# EAGLE design VGA_sound (EAGLE 7.7.0)
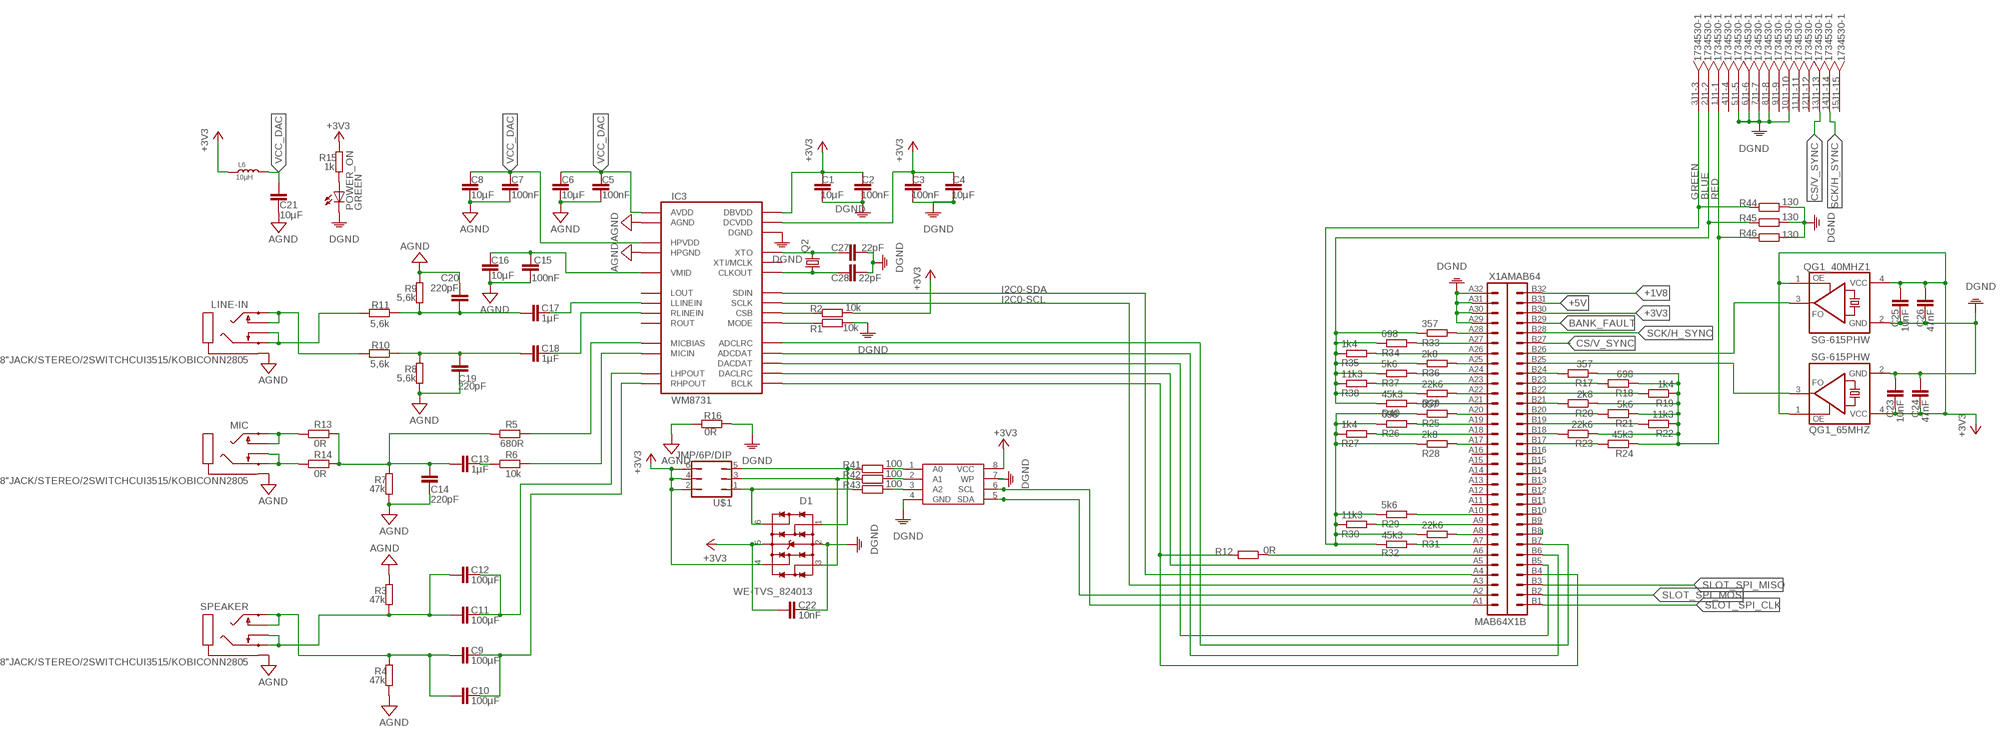
[diagram p0: schematic, sheet 1]

## Parts
C1  10µF  C-EUC0603  [C0603]
C2  100nF  C-EUC0603  [C0603]
C3  100nF  C-EUC0603K  [C0603K]
C4  10µF  C-EUC0603K  [C0603K]
C5  100nF  C-EUC0603K  [C0603K]
C6  10µF  C-EUC0603K  [C0603K]
C7  100nF  C-EUC0603K  [C0603K]
C8  10µF  C-EUC0603K  [C0603K]
C9  100µF  C-EUC1206  [C1206]
C10  100µF  C-EUC1206  [C1206]
C11  100µF  C-EUC1206  [C1206]
C12  100µF  C-EUC1206  [C1206]
C13  1µF  C-EUC0603  [C0603]
C14  220pF  C-EUC0603  [C0603]
C15  100nF  C-EUC0603  [C0603]
C16  10µF  C-EUC0603  [C0603]
C17  1µF  C-EUC0603  [C0603]
C18  1µF  C-EUC0603  [C0603]
C19  220pF  C-EUC0603  [C0603]
C20  220pF  C-EUC0603  [C0603]
C21  10µF  C-EUC0603  [C0603]
C22  10nF  C-EUC0603  [C0603]
C23  10nF  C-EUC0603  [C0603]
C24  47nF  C-EUC0603  [C0603]
C25  10nF  C-EUC0603  [C0603]
C26  47nF  C-EUC0603  [C0603]
C27  22pF  C-EUC0603  [C0603]
C28  22pF  C-EUC0603K  [C0603K]
D1  WE-TVS_824013  [WE-TVS_SOT23-6L]
IC1  EEPROM  [SOIC-8]
IC3  WM8731  [28-SSOP]
J1  1734530-1  [HD15_FEMALE_RIGHT-ANGLE]
L6  10µH  SMD-INDUCTOR-2.2UH-20%-1.2A(0805)  [L0805]
LINE-IN  1/8"JACK/STEREO/2SWITCHCUI3515/KOBICONN2805  [1/8"JACK/STEREO/SMT]
MIC  1/8"JACK/STEREO/2SWITCHCUI3515/KOBICONN2805  [1/8"JACK/STEREO/SMT]
POWER_ON  GREEN  LEDCHIP-LED0603  [CHIP-LED0603]
Q2  CRYTALSM49  [SM49]
QG1_40MHZ1  SG-615PHW  [SG-615]
QG1_65MHZ  SG-615PHW  [SG-615]
R1  10k  R-EU_R0603  [R0603]
R2  10k  R-EU_R0603  [R0603]
R3  47k  R-EU_R0603  [R0603]
R4  47k  R-EU_R0603  [R0603]
R5  680R  R-EU_R0603  [R0603]
R6  10k  R-EU_R0603  [R0603]
R7  47k  R-EU_R0603  [R0603]
R8  5,6k  R-EU_R0603  [R0603]
R9  5,6k  R-EU_R0603  [R0603]
R10  5,6k  R-EU_R0603  [R0603]
R11  5,6k  R-EU_R0603  [R0603]
R12  0R  R-EU_R0603  [R0603]
R13  0R  R-EU_R0603  [R0603]
R14  0R  R-EU_R0603  [R0603]
R15  1k  R-EU_R0603  [R0603]
R16  0R  R-EU_R0603  [R0603]
R17  357  R-EU_R0603  [R0603]
R18  698  R-EU_R0603  [R0603]
R19  1k4  R-EU_R0603  [R0603]
R20  2k8  R-EU_R0603  [R0603]
R21  5k6  R-EU_R0603  [R0603]
R22  11k3  R-EU_R0603  [R0603]
R23  22k6  R-EU_R0603  [R0603]
R24  45k3  R-EU_R0603  [R0603]
R25  357  R-EU_R0603  [R0603]
R26  698  R-EU_R0603  [R0603]
R27  1k4  R-EU_R0603  [R0603]
R28  2k8  R-EU_R0603  [R0603]
R29  5k6  R-EU_R0603  [R0603]
R30  11k3  R-EU_R0603  [R0603]
R31  22k6  R-EU_R0603  [R0603]
R32  45k3  R-EU_R0603  [R0603]
R33  357  R-EU_R0603  [R0603]
R34  698  R-EU_R0603  [R0603]
R35  1k4  R-EU_R0603  [R0603]
R36  2k8  R-EU_R0603  [R0603]
R37  5k6  R-EU_R0603  [R0603]
R38  11k3  R-EU_R0603  [R0603]
R39  22k6  R-EU_R0603  [R0603]
R40  45k3  R-EU_R0603  [R0603]
R41  100  R-EU_R0603  [R0603]
R42  100  R-EU_R0603  [R0603]
R43  100  R-EU_R0603  [R0603]
R44  130  R-EU_R0603  [R0603]
R45  130  R-EU_R0603  [R0603]
R46  130  R-EU_R0603  [R0603]
SPEAKER  1/8"JACK/STEREO/2SWITCHCUI3515/KOBICONN2805  [1/8"JACK/STEREO/SMT]
U$1  JMP/6P/DIP  [JMP/6P/DIP]
X1  MAB64  [MAB64]

## Nets
+1V8: X1.B32
+3V3: C1.2 C2.2 C3.2 C4.2 C22.2 C23.1 C24.1 C25.2 C26.2 D1.4 D1.5(VDD) IC1.8(VCC) IC3.P$1(DBVDD) IC3.P$27(DCVDD) L6.1 QG1_40MHZ1.1(OE) QG1_40MHZ1.4(VCC) QG1_65MHZ.1(OE) QG1_65MHZ.4(VCC) R2.2 R15.2 U$1.2 U$1.4 U$1.6 X1.B30
+5V: X1.B31
AGND: C5.1 C6.1 C7.1 C8.1 C14.1 C15.1 C16.1 C19.2 C20.1 C21.1 IC3.P$11(HPGND) IC3.P$15(AGND) LINE-IN.P$1 MIC.P$1 R3.2 R4.1 R7.1 R8.1 R9.2 R16.2 SPEAKER.P$1
BANK_FAULT: X1.B29
CS/V_SYNC: J1.13 X1.B27
DGND: C1.1 C2.1 C3.1 C4.1 C22.1 C23.2 C24.2 C25.1 C26.1 C27.1 C28.1 D1.2(GND) IC1.4(GND) IC1.7(WP) IC3.P$28(DGND) J1.5 J1.6 J1.7 J1.8 J1.10 POWER_ON.C QG1_40MHZ1.2(GND) QG1_65MHZ.2(GND) R1.2 R16.1 R44.2 R45.2 R46.2 X1.A29 X1.A30 X1.A31 X1.A32
I2C0-SCL: IC3.P$24(SCLK) X1.A3
I2C0-SDA: IC3.P$23(SDIN) X1.A4
N$1: IC3.P$21(MODE) R1.1
N$2: IC3.P$22(CSB) R2.1
N$3: C9.1 C10.1 IC3.P$10(RHPOUT)
N$4: C27.2 IC3.P$26(XTO) Q2.2
N$5: C11.1 C12.1 IC3.P$9(LHPOUT)
N$6: C28.2 IC3.P$2(CLKOUT) Q2.1
N$7: IC3.P$17(MICBIAS) R5.2
N$8: IC3.P$18(MICIN) R6.2
N$9: C13.1 R6.1
N$10: IC3.P$6(ADCDAT) X1.B6
N$11: C17.1 IC3.P$20(LLINEIN)
N$12: C17.2 C20.2 R9.1 R11.1
N$13: C18.1 IC3.P$19(RLINEIN)
N$14: C18.2 C19.1 R8.2 R10.1
N$15: IC1.1(A0) R41.2
N$16: IC3.P$4(DACDAT) X1.B5
N$17: LINE-IN.P$2 LINE-IN.P$3 R11.2
N$18: LINE-IN.P$4 LINE-IN.P$5 R10.2
N$19: C13.2 C14.2 R5.1 R7.2 R13.2 R14.2
N$20: MIC.P$4 MIC.P$5 R13.1
N$21: MIC.P$2 MIC.P$3 R14.1
N$22: POWER_ON.A R15.1
N$23: C11.2 C12.2 R3.1 SPEAKER.P$2 SPEAKER.P$3
N$24: IC3.P$7(ADCLRC) X1.B7
N$25: C9.2 C10.2 R4.2 SPEAKER.P$4 SPEAKER.P$5
N$26: IC3.P$5(DACLRC) X1.A5
N$27: R12.1 X1.A6
N$28: R33.2 X1.A28
N$29: R34.2 X1.A27
N$30: IC1.6(SCL) X1.A1
N$31: R35.2 X1.A26
N$32: R36.2 X1.A25
N$33: R38.2 X1.A23
N$34: R39.2 X1.A22
N$35: R40.2 X1.A21
N$36: R25.2 X1.A20
N$37: R17.2 X1.B24
N$38: R18.2 X1.B23
N$39: R19.2 X1.B22
N$40: IC3.P$3(BCLK) R12.2 X1.B4
N$41: R20.2 X1.B21
N$42: R21.2 X1.B20
N$43: R22.2 X1.B19
N$44: R23.2 X1.B18
N$45: QG1_65MHZ.3(FO) X1.B25
N$46: R24.2 X1.B17
N$47: R26.2 X1.A19
N$48: IC1.2(A1) R42.2
N$49: IC1.3(A2) R43.2
N$50: J1.3 R25.1 R26.1 R27.1 R28.1 R29.1 R30.1 R31.1 R32.1 R44.1
N$51: R27.2 X1.A18
N$52: D1.1 R41.1 U$1.5
N$53: D1.3 R42.1 U$1.3
N$54: R28.2 X1.A17
N$55: D1.6 R43.1 U$1.1
N$56: QG1_40MHZ1.3(FO) X1.B26
N$57: R37.2 X1.A24
N$58: R29.2 X1.A10
N$59: R32.2 X1.A7
N$60: R31.2 X1.A8
N$61: R30.2 X1.A9
N$62: J1.1 R17.1 R18.1 R19.1 R20.1 R21.1 R22.1 R23.1 R24.1 R46.1
N$63: IC1.5(SDA) X1.A2
N$64: X1.B8
N$67: J1.2 R33.1 R34.1 R35.1 R36.1 R37.1 R38.1 R39.1 R40.1 R45.1
N$86: C15.2 C16.2 IC3.P$16(VMID)
SCK/H_SYNC: J1.14 X1.B28
SLOT_SPI_CLK: X1.B1
SLOT_SPI_MISO: X1.B3
SLOT_SPI_MOSI: X1.B2
VCC_DAC: C5.2 C6.2 C7.2 C8.2 C21.2 IC3.P$8(HPVDD) IC3.P$14(AVDD) L6.2
Unconnected: IC3.P$12(LOUT) IC3.P$13(ROUT) IC3.P$25(XTI/MCLK) J1.4 J1.9 J1.11 J1.12 J1.15 J1.SHIELD-1 J1.SHIELD-2 X1.A11 X1.A12 X1.A13 X1.A14 X1.A15 X1.A16 X1.B9 X1.B10 X1.B11 X1.B12 X1.B13 X1.B14 X1.B15 X1.B16

## Notes on the sheet
- GREEN | BLUE | RED

## Library data of the parts
C1-C28 = Daisy16lbr:C-EU: CAPACITOR, European symbol
D1 = EagleLibrary_Wuerth_Elektronik_eiSos_rev16a:WE-TVS_824013: TVS Diode High Speed Series Characteristics Low clamping voltage Sturdy design Very low capacitance Flow Thru Design for a simple layout Rail to Rail protection Epoxy flame resistant UL94 V-0 RoHS, REACH and free of halogens Applications Very fast data lines USB 2.0 Ethernet PoE VGA Sim Cards Keypads ESD protection in accordance with EN 61000-4-2, – 8 kV contact discharge – 15 kV air discharge <http://katalog.we-online.de/media/images/eisos/VarTVS_highspeed_pf2.jpg.jpg> Details see: http://katalog.we-online.de/en/pbs/WE-TVS_High_Speed/824001? Updated by Dan Xu 2014-07-11 2014 (C) Wurth Elektronik
IC1 = EEPROM:EEPROM
IC3 = wm8731:WM8731
J1 = vga:1734530-1: 15-Pin High Density Female D-Sub Connector Documentation Drawing <http://www.te.com/commerce/DocumentDelivery/DDEController?Action=srchrtrv&DocNm=1734530&DocType=Customer+Drawing&DocLang=English>; COLOR: Black; CONNECTOR_STYLE: D-Sub, High Density; CONNECTOR_TYPE: Receptacle, Female Sockets; CONTACT_FINISH: Gold; CONTACT_FINISH_THICKNESS: Flash; CONTACT_TYPE: Signal; CURRENT_RATING: 2A; DESCRIPTION: CONN DSUB HD RCPT 15POS R/A SLDR; DOCUMENTATION_LINK: <a href="http://www.te.com/commerce/DocumentDelivery/DDEController?Action=srchrtrv&DocNm=1734530&DocType=Customer+Drawing&DocLang=English">Datasheet</a>; DOCUMENTATION_URL: http://www.te.com/commerce/DocumentDelivery/DDEController?Action=srchrtrv&DocNm=1734530&DocType=Customer+Drawing&DocLang=English; FEATURES: Board Lock; FLANGE_FEATURE: Housing/Shell (4-40); HOUSING_MATERIAL: Polyamide (PA9T), Nylon 9T; MANUFACTURER: TE Connectivity; MOUNTINT_TYPE: Through Hole, Right Angle; NUMBER_POSITIONS: 15; NUMBER_ROWS: 3; OPERATING_TEMPERATURE: -55 ~ 105C; PART_NUMBER: 1-1734530-1; SERIES: AMPLIMITE HD-22, AMP; SHELL_MATERIAL: Steel, Nickel Plated; SHELL_SIZE: 1 (DE, E) High Density; SUPPLIER_ITEM_LINK: <a href="http://www.digikey.com/product-search/en?KeyWords=A35116-ND&WT.z_header=search_go">Details</a>; SUPPLIER_ITEM_NUMBER: A35116-ND; SUPPLIER_ITEM_URL: http://www.digikey.com/product-search/en?KeyWords=A35116-ND&WT.z_header=search_go; SUPPLIER_LINK: <a href="http://www.digikey.com">Home Page</a>; SUPPLIER_NAME: Digi-Key; SUPPLIER_URL: http://www.digikey.com; TERMINATION: Solder; VOLTAGE_RATING: 125V
L6 = Seeed-OPL-Inductor:SMD-INDUCTOR-2.2UH-20%-1.2A(0805): 303010086; MPN: LQM2MPN2R2MG0; VALUE: 2.2UH-1.2A
LINE-IN MIC SPEAKER = wm8731:1/8"JACK/STEREO/2SWITCH
POWER_ON = led:LED: LED OSRAM: - CHIPLED LG R971, LG N971, LY N971, LG Q971, LY Q971, LO R971, LY R971 LH N974, LH R974 LS Q976, LO Q976, LY Q976 LO Q996 - Hyper CHIPLED LW Q18S LB Q993, LB Q99A, LB R99A - SideLED LS A670, LO A670, LY A670, LG A670, LP A670 LB A673, LV A673, LT A673, LW A673 LH A674 LY A675 LS A676, LA A676, LO A676, LY A676, LW A676 LS A679, LY A679, LG A679 - Hyper Micro SIDELED® LS Y876, LA Y876, LO Y876, LY Y876 LT Y87S - SmartLED LW L88C, LW L88S LB L89C, LB L89S, LG L890 LS L89K, LO L89K, LY L89K LS L896, LA L896, LO L896, LY L896 - TOPLED LS T670, LO T670, LY T670, LG T670, LP T670 LSG T670, LSP T670, LSY T670, LOP T670, LYG T670 LG T671, LOG T671, LSG T671 LB T673, LV T673, LT T673, LW T673 LH T674 LS T676, LA T676, LO T676, LY T676, LB T676, LH T676, LSB T676, LW T676 LB T67C, LV T67C, LT T67C, LS T67K, LO T67K, LY T67K, LW E67C LS E67B, LA E67B, LO E67B, LY E67B, LB E67C, LV E67C, LT E67C LW T67C LS T679, LY T679, LG T679 LS T770, LO T770, LY T770, LG T770, LP T770 LB T773, LV T773, LT T773, LW T773 LH T774 LS E675, LA E675, LY E675, LS T675 LS T776, LA T776, LO T776, LY T776, LB T776 LHGB T686 LT T68C, LB T68C - Hyper Mini TOPLED® LB M676 - Mini TOPLED Santana® LG M470 LS M47K, LO M47K, LY M47K Source: http://www.osram.convergy.de LUXEON: - LUMILED® LXK2-PW12-R00, LXK2-PW12-S00, LXK2-PW14-U00, LXK2-PW14-V00 LXK2-PM12-R00, LXK2-PM12-S00, LXK2-PM14-U00 LXK2-PE12-Q00, LXK2-PE12-R00, LXK2-PE12-S00, LXK2-PE14-T00, LXK2-PE14-U00 LXK2-PB12-K00, LXK2-PB12-L00, LXK2-PB12-M00, LXK2-PB14-N00, LXK2-PB14-P00, LXK2-PB14-Q00 LXK2-PR12-L00, LXK2-PR12-M00, LXK2-PR14-Q00, LXK2-PR14-R00 LXK2-PD12-Q00, LXK2-PD12-R00, LXK2-PD12-S00 LXK2-PH12-R00, LXK2-PH12-S00 LXK2-PL12-P00, LXK2-PL12-Q00, LXK2-PL12-R00 Source: www.luxeon.com KINGBRIGHT: KA-3528ASYC Source: www.kingbright.com
Q2 = 0_HTL_MegaCard_V3:CRYTAL: CRYSTAL
QG1_40MHZ1 QG1_65MHZ = crystal:SG-615: SOJ HIGH-FREQUENCY CRYSTAL OSCILLATOR Source: Crystal Oscillator SG-615%20Series.pdf; OC_FARNELL: unknown; OC_NEWARK: unknown
R1-R11 R41-R43 = Daisy16lbr:R-EU_: RESISTOR, European symbol
R12-R40 R44-R46 = resistor:R-EU_: RESISTOR, European symbol
U$1 = wm8731:JMP/6P/DIP
X1 = con-vg:MAB64: CONNECTOR male, 94 pins, type B, rows AB, grid 2.54 mm

## Board
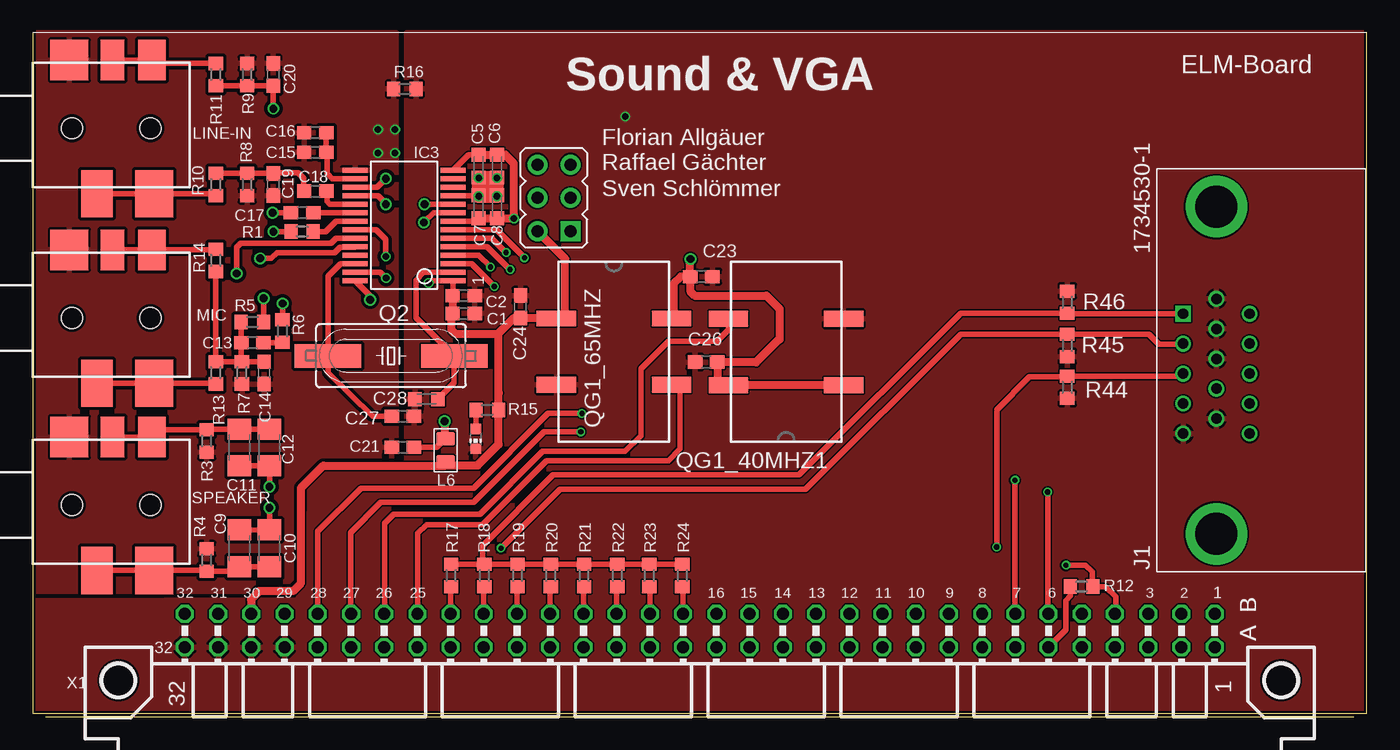
[diagram p1: board, top side]
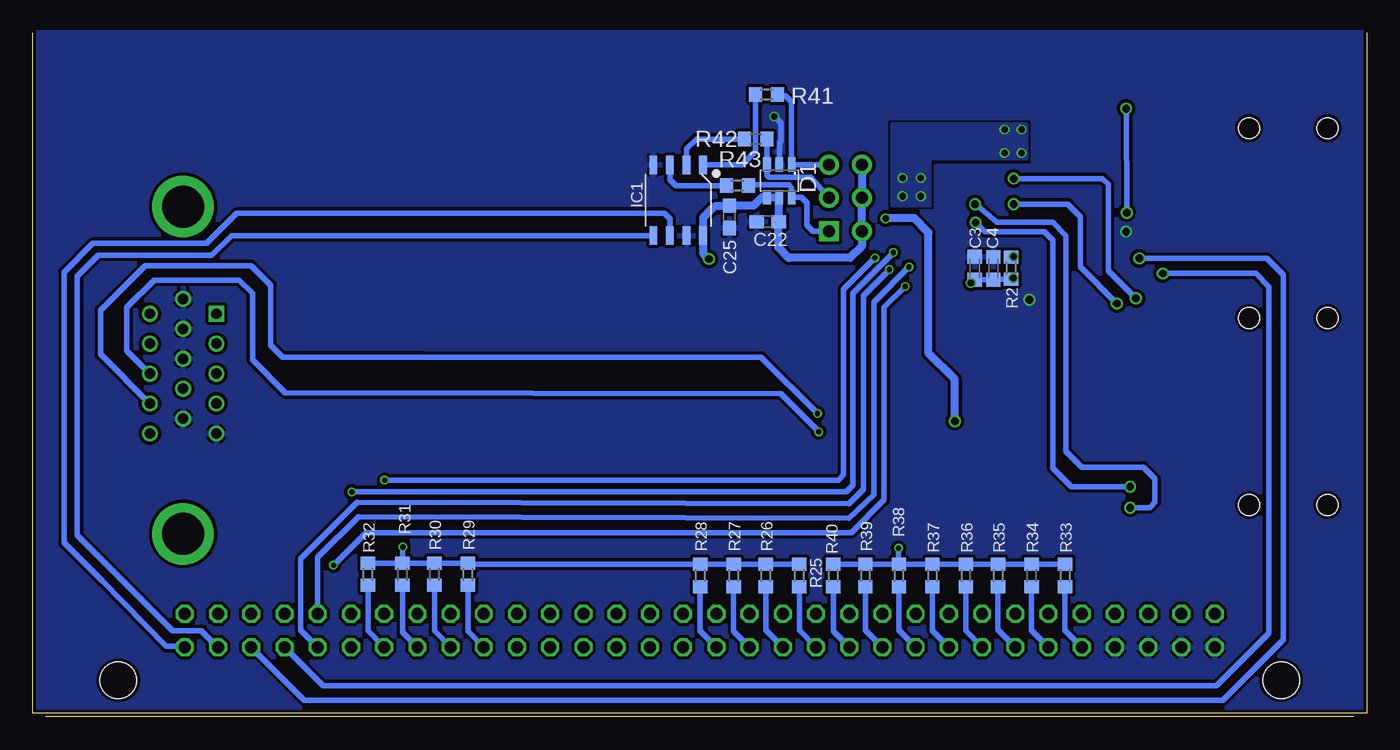
[diagram p2: board, bottom side, seen from below]

Size 102 x 52.29 mm. Coordinates in mm from the lower left corner, seen from the top.
Outline: 102,52.29 102,0.29 0,0.29 0,52.29
Copper layers (1*16): Top 0.018mm / dielectric 1.55mm / Bottom 0.018mm
Design rules "Multi-CB_2L_125um-Tracks_OL35um": minimum track width 0.125mm, minimum drill 0.2mm, track to track 0.125mm, track to pad 0.125mm, pad to pad 0.125mm, via to via 0.125mm, smd to smd 0mil, copper to edge 0.2mm, drill to drill 0.2mm, minimum pad ring 0.125mm, minimum via ring 0.125mm, stop-mask expansion 2mil, vias tented up to drill 0.45mm, thermal gap 0.2mm

### Footprints (pad centres in the part's own frame; a part is rotated, then mirrored left to right if it is on the bottom)
C0603 = smd 1.1 x 1: 1 -0.85,0; 2 0.85,0
C0603K = smd 1.05 x 1.08: 1 -0.875,0; 2 0.875,0
C1206 = smd 1.6 x 1.8: 1 -1.4,0; 2 1.4,0
WE-TVS_SOT23-6L = smd 0.6 x 1.1: 1 -0.95,-1.25; 2 0,-1.25; 3 0.95,-1.25; 4 0.95,1.25; 5 0,1.25; 6 -0.95,1.25
SOIC-8 = smd 0.6 x 1.4: 1 -1.905,-2.7; 2 -0.635,-2.7; 3 0.635,-2.7; 4 1.905,-2.7; 5 1.905,2.7; 6 0.635,2.7; 7 -0.635,2.7; 8 -1.905,2.7
28-SSOP = smd 0.381 x 1.905: P$1 -4.55,-3.752; P$2 -3.9,-3.752; P$3 -3.25,-3.752; P$4 -2.6,-3.752; P$5 -1.95,-3.752; P$6 -1.3,-3.752; P$7 -0.65,-3.752; P$8 0,-3.752; P$9 0.65,-3.752; P$10 1.3,-3.752; P$11 1.95,-3.752; P$12 2.6,-3.752; P$13 3.25,-3.752; P$14 3.9,-3.752; P$15 3.9,3.752; P$16 3.25,3.752; P$17 2.6,3.752; P$18 1.95,3.752; P$19 1.3,3.752; P$20 0.65,3.752; P$21 0,3.752; P$22 -0.65,3.752; P$23 -1.3,3.752; P$24 -1.95,3.752; P$25 -2.6,3.752; P$26 -3.25,3.752; P$27 -3.9,3.752; P$28 -4.55,3.752
HD15_FEMALE_RIGHT-ANGLE = drill 0.8 square: 1 4.32,2.54 | drill 0.8: 2 2.03,2.54; 3 -0.26,2.54; 4 -2.55,2.54; 5 -4.84,2.54; 6 5.46,0; 7 3.17,0; 8 0.88,0; 9 -1.41,0; 10 -3.7,0; 11 4.32,-2.54; 12 2.03,-2.54; 13 -0.26,-2.54; 14 -2.55,-2.54; 15 -4.84,-2.54 | drill 3.2: SHIELD-1 -12.5,0; SHIELD-2 12.5,0
L0805 = smd 1.016 x 1.397: 1 -0.889,0; 2 0.889,0
1/8"JACK/STEREO/SMT = smd 3.1 x 2.9: P$1 5.2,-2.8 | smd 3.1 x 1.8: P$2 5.2,-6.1 | smd 3.1 x 2.1: P$3 5.2,-9.1 | smd 3.6 x 2.4: P$4 -5,-4.9 | smd 3.6 x 2.9: P$5 -5,-9.3 | hole 1.6: 0,-9; 0,-3
CHIP-LED0603 = smd 0.8 x 0.8: A 0,-0.75; C 0,0.75
SM49 = smd 5.08 x 1.778: 1 -4.826,0; 2 4.826,0
SG-615 = smd 1.2 x 3: 1 -2.54,-4.4; 2 2.54,-4.4; 3 2.54,4.4; 4 -2.54,4.4
R0603 = smd 1 x 1.1: 1 -0.85,0; 2 0.85,0
JMP/6P/DIP = drill 0.914 pad 1.524 square: 1 -2.54,-1.27 | drill 0.914 pad 1.524: 2 -2.54,1.27; 3 0,-1.27; 4 0,1.27; 5 2.54,-1.27; 6 2.54,1.27
MAB64 = drill 0.914 octagon: A1 -2.54,39.37; A2 -2.54,36.83; A3 -2.54,34.29; A4 -2.54,31.75; A5 -2.54,29.21; A6 -2.54,26.67; A7 -2.54,24.13; A8 -2.54,21.59; A9 -2.54,19.05; A10 -2.54,16.51; A11 -2.54,13.97; A12 -2.54,11.43; A13 -2.54,8.89; A14 -2.54,6.35; A15 -2.54,3.81; A16 -2.54,1.27; A17 -2.54,-1.27; A18 -2.54,-3.81; A19 -2.54,-6.35; A20 -2.54,-8.89; A21 -2.54,-11.43; A22 -2.54,-13.97; A23 -2.54,-16.51; A24 -2.54,-19.05; A25 -2.54,-21.59; A26 -2.54,-24.13; A27 -2.54,-26.67; A28 -2.54,-29.21; A29 -2.54,-31.75; A30 -2.54,-34.29; A31 -2.54,-36.83; A32 -2.54,-39.37; B1 -5.08,39.37; B2 -5.08,36.83; B3 -5.08,34.29; B4 -5.08,31.75; B5 -5.08,29.21; B6 -5.08,26.67; B7 -5.08,24.13; B8 -5.08,21.59; B9 -5.08,19.05; B10 -5.08,16.51; B11 -5.08,13.97; B12 -5.08,11.43; B13 -5.08,8.89; B14 -5.08,6.35; B15 -5.08,3.81; B16 -5.08,1.27; B17 -5.08,-1.27; B18 -5.08,-3.81; B19 -5.08,-6.35; B20 -5.08,-8.89; B21 -5.08,-11.43; B22 -5.08,-13.97; B23 -5.08,-16.51; B24 -5.08,-19.05; B25 -5.08,-21.59; B26 -5.08,-24.13; B27 -5.08,-26.67; B28 -5.08,-29.21; B29 -5.08,-31.75; B30 -5.08,-34.29; B31 -5.08,-36.83; B32 -5.08,-39.37 | hole 2.794: 0,44.45; 0,-44.45

### Placement (x,y rotation side)
C1  32.95,30.83 180 top
C2  32.95,32.19 180 top
C3  29.98,34.29 270 bottom
C4  28.56,34.28 270 bottom
C5  34.1,42.09 90 top
C6  35.5,42.09 90 top
C7  34.1,38.99 270 top
C8  35.5,38.99 270 top
C9  15.8,12.89 270 top
C10  18.1,12.89 270 top
C11  15.8,20.59 90 top
C12  18.1,20.59 90 top
C13  16.8,28.59 180 top
C14  17.7,26.29 90 top
C15  21.6,43.14 0 top
C16  21.6,44.64 0 top
C17  20.6,38.54 180 top
C18  21.6,40.19 180 top
C19  18.4,40.69 270 top
C20  18.4,49.09 270 top
C21  28.3,20.6 0 top
C22  45.81,37.83 0 bottom
C23  51.11,33.66 0 top
C24  37.29,31.35 90 top
C25  48.74,38.22 90 bottom
C26  51.49,27.12 0 top
C27  28.3,22.99 180 top
C28  30.1,24.29 0 top
D1  44.92,40.97 180 bottom
IC1  52.65,39.49 180 bottom
IC3  28.4,37.89 90 top
J1  90.5,26.49 90 top
L6  31.58,20.38 90 top
LINE-IN  0,44.99 90 top
MIC  0,30.49 90 top
POWER_ON  33.87,21.25 180 top
Q2  27.4,27.59 180 top
QG1_40MHZ1  57.6,27.89 90 top
QG1_65MHZ  44.44,27.92 270 top
R1  20.6,37.09 180 top
R2  27.2,34.29 270 bottom
R3  13.3,21.09 270 top
R4  13.3,11.99 270 top
R5  16.8,30.19 0 top
R6  19.1,29.49 90 top
R7  16,26.29 90 top
R8  16.4,40.69 90 top
R9  16.4,49.09 90 top
R10  14,40.69 270 top
R11  14,49.09 90 top
R12  80.2,9.97 0 top
R13  14,26.29 90 top
R14  14,34.89 270 top
R15  34.76,23.46 0 top
R16  28.45,47.99 180 top
R17  31.99,10.8 270 top
R18  34.53,10.8 270 top
R19  37.07,10.8 270 top
R20  39.61,10.8 270 top
R21  42.15,10.8 270 top
R22  44.69,10.8 270 top
R23  47.13,10.8 270 top
R24  49.67,10.8 270 top
R25  43.39,10.8 270 bottom
R26  45.95,10.8 270 bottom
R27  48.41,10.8 270 bottom
R28  50.97,10.8 270 bottom
R29  68.73,10.9 270 bottom
R30  71.29,10.9 270 bottom
R31  73.73,10.9 270 bottom
R32  76.37,10.9 270 bottom
R33  23.07,10.8 270 bottom
R34  25.63,10.8 270 bottom
R35  28.19,10.8 270 bottom
R36  30.65,10.8 270 bottom
R37  33.21,10.8 270 bottom
R38  35.77,10.8 270 bottom
R39  38.33,10.8 270 bottom
R40  40.79,10.8 270 bottom
R41  45.9,47.57 180 bottom
R42  46.72,44.17 180 bottom
R43  48.12,40.61 180 bottom
R44  79.1,25.19 270 top
R45  79.1,28.39 270 top
R46  79.1,31.69 90 top
SPEAKER  0,16.19 90 top
U$1  39.85,39.68 90 top
X1  51,2.79 270 top

### Tracks (layer width: path | path; a pad name or v marks a point on that pad's centre or on a via)
+3V3  (via drill 0.5, 0.6)
  Top 0.406: 35.62,24.74 R15.2 | X1.B30 | 31.61,19.22 L6.1 31.55,19.21 | v30.27,33.16 30.35,33.34 IC3.P$1 32.15,31.92 C2.2 | IC3.P$27 26.57,33.99 v27.02,33.54 | 32,30.43 C1.2 | 35.6,29.29 35.62,29.32 | 57.1,28.85 57.06,28.85 | 52.37,27.09 C26.2 | 52.37,25.35 QG1_40MHZ1.4
  Top 0.61: 31.55,19.21 22.22,19.21 20.52,17.51 20.52,10.23 19.9,9.61 17.31,9.61 16.7,8.99 X1.B30 | 35.62,24.74 35.62,20.83 34.01,19.22 31.61,19.22 | 35.62,24.74 35.62,29.32 36.8,30.49 C24.1 40.7,30.5 | C2.2 C1.2 | 40.7,30.5 QG1_65MHZ.1 | 40.7,30.5 40.7,35.02 U$1.2 | 32,30.43 32,29.59 32.3,29.29 35.6,29.29 | 57.1,28.85 57.1,31.19 56.1,32.19 50.6,32.19 50.3,32.49 50.3,33.62 C23.1 | 57.06,28.85 55.3,27.09 52.37,27.09 52.37,25.35 | QG1_40MHZ1.1 QG1_40MHZ1.4 | C23.1 49.56,33.66 49,33.09 49,30.62 QG1_65MHZ.4 | C23.1 50.26,34.96 v50.3,34.99
  Bottom 0.406: 38.61,37.11 U$1.2 | 44.93,39.71 D1.5 | 50.74,36.8 IC1.8 | v30.27,33.16 30.27,33.42 C3.2 28.37,33.42 | C4.2 28.37,33.42 | 28.37,33.42 28.34,33.44 R2.2 27.12,33.44 v27.02,33.54
  Bottom 0.61: U$1.2 U$1.4 U$1.6 | D1.5 D1.4 46.24,39.72 46.88,39.07 C25.2 48.79,39.02 49.86,39.02 50.74,38.14 50.74,36.8 | 44.93,39.71 C22.2 45,37.79 45,35.89 44.2,35.09 39.5,35.09 38.61,35.99 38.61,37.11 | IC1.8 50.75,35.44 v50.3,34.99
AGND  (via drill 0.5)
  Top 0.406: C8.1 v35.5,39.79 | v35.5,41.19 C6.1 | 34.1,39.84 v34.1,39.79 34.05,39.84 IC3.P$11
  Top 1.016: C7.1 v34.1,39.79 | 34.1,40.59 v34.1,41.19 | v34.1,41.19 C5.1 | v34.1,41.19 35.48,41.19 C6.1 | v35.5,41.19 35.5,40.59 | v34.1,39.79 v35.5,39.79 35.5,40.59 | 35.5,40.59 34.1,40.59 | 34.1,40.59 v34.1,39.79
  other vias: 26.4,44.89 27.7,44.89 26.4,43.09 27.7,43.09
  pour Top (isolate 0.254): 0,52.29 27.8,52.29 27.8,19.82 22.01,19.76 20.3,17.79 20.3,10.56 19.65,10.26 17.06,10.26 16.3,9.59 0,9.56
  pour Bottom (no thermals): 26,45.29 36.3,45.29 36.3,39.09 33.4,39.09 33.4,42.69 26,42.69
CS/V_SYNC  (via drill 0.4)
  Top 0.406: v41.9,21.79 39.1,21.79 33.7,16.39 26.6,16.39 24.3,14.09 24.3,7.9 X1.B27
  Bottom 0.406: v41.9,21.79 44.8,24.69 82.7,24.79 85.2,27.29 85.2,32.39 86.2,33.39 92.7,33.39 94.8,31.29 94.8,27.99 J1.13
DGND  (via drill 0.5, 0.6)
  Top 0.406: R1.2 v18.4,37.09 | v25.8,31.89 25.8,32.19 IC3.P$28
  Bottom 0.406: v45.3,45.89 44.8,45.39 44.8,43.99 44.92,43.87 D1.2
  pour Top: 28.6,52.29 102,52.29 102,0.29 0,0.29 -0.13,8.88 20.17,8.94 20.55,9.42 21.11,9.97 21.12,14.08 21.16,17.31 22.82,18.96 28.6,18.96
  pour Bottom (isolate 0.254): 0,52.29 25.5,52.29 25.5,42.07 32.9,42.09 32.9,38.59 36.8,38.59 36.8,45.79 25.7,45.79 25.7,52.29 102,52.29 102,0.29 0,0.29
  pour Bottom (no thermals): 23.9,52.29 27,52.29 27.11,45.79 24.01,45.79
I2C0-SCL  (via drill 0.6)
  Top 0.406: v17.4,35.04 18.25,35.04 18.7,35.49 23.1,35.49 23.5,35.89 24.6,35.89 IC3.P$24
  Bottom 0.406: v17.4,35.04 7.65,35.04 6.4,33.79 6.4,5.89 11,1.29 81.25,1.29 X1.A3
I2C0-SDA  (via drill 0.6)
  Top 0.406: v15.6,33.89 15.6,35.89 15.9,36.19 22.8,36.19 23.2,36.59 IC3.P$23
  Bottom 0.406: v15.6,33.89 8.5,33.89 7.5,32.89 7.5,6.39 11.5,2.39 79.81,2.39 X1.A4
N$1
  Top 0.406: IC3.P$21 23.2,37.89 22.4,37.09 R1.1
N$2  (via drill 0.5)
  Top 0.406: IC3.P$22 26.25,37.24 27,36.49 v27,35.19
  Bottom 0.406: R2.1 27.2,34.99 v27,35.19
N$3  (via drill 0.6)
  Top 0.406: v29.95,39.19 IC3.P$10 | C9.1 18.1,14.27 C10.1 v18.1,15.99
  Bottom 0.406: v29.95,39.19 29.8,39.09 28.3,37.79 24,37.79 23,36.79 23,20.29 21.8,19.09 17.1,19.09 16.2,18.19 16.2,16.39 16.6,15.99 v18.1,15.99
N$4
  Top 0.406: IC3.P$26 23.55,34.64 22.6,33.69 22.6,27.62 Q2.2 22.57,26.32 26,22.99 C27.2
N$5  (via drill 0.6)
  Top 0.406: C11.1 C12.1 v18.1,17.59 | 32.2,38.54 IC3.P$9 30.65,38.54 v29.9,37.79
  Bottom 0.406: v18.1,17.59 22.6,17.59 24,18.99 24,36.44 24.65,37.09 29.2,37.09 v29.9,37.79
N$6
  Top 0.406: IC3.P$2 29.9,33.99 29.3,33.39 29.3,30.52 Q2.1 32.23,25.55 C28.2
N$7  (via drill 0.6)
  Top 0.406: R5.2 v17.65,31.99 | v27,41.14 26.35,40.49 IC3.P$17
  Bottom 0.406: v27,41.14 20.2,41.14 19.75,40.69 19.75,34.09 v17.65,31.99
N$8  (via drill 0.6)
  Top 0.406: R6.2 v19.1,31.59 | v27,39.19 26.8,39.44 26.4,39.84 IC3.P$18
  Bottom 0.406: v27,39.19 22.85,39.19 21.9,38.24 21.9,34.39 v19.1,31.59
N$9
  Top 0.406: C13.1 19.45,28.59 R6.1
N$10  (via drill 0.4)
  Top 0.406: IC3.P$6 35.1,36.59 v36.2,35.49 | v77.6,17.19 77.6,7.94 X1.B6
  Bottom 0.406: v36.2,35.49 39.3,32.39 39.3,17.69 39.8,17.19 v77.6,17.19
N$11
  Top 0.406: IC3.P$20 C17.1
N$12  (via drill 0.6)
  Top 0.406: R11.1 R9.1 18.38,48.24 C20.2 v18.4,46.49 | v18.35,38.54 C17.2
  Bottom 0.406: v18.4,46.49 v18.35,38.54
N$13
  Top 0.406: IC3.P$19 22.7,39.19 22.5,39.39 22.5,40.17 C18.1
N$14
  Top 0.406: R10.1 R8.2 18.38,41.54 C19.1 18.43,41.59 20.3,41.59 20.73,41.17 C18.2
N$15
  Bottom 0.406: IC1.1 50.73,42.2 47.75,42.2 46.73,43.22 46.73,46.36 R41.2
N$16  (via drill 0.4)
  Top 0.406: IC3.P$4 34.1,35.29 v35,34.39
  Bottom 0.406: v35,34.39 37.7,31.69 37.7,16.99 39.6,15.19 77.1,15.29 80.2,12.19 X1.B5
N$17
  Top 0.406: LINE-IN.P$2 LINE-IN.P$3 9.35,49.94 R11.2 13.95,49.99
N$18
  Top 0.406: LINE-IN.P$4 LINE-IN.P$5 13.75,39.99 13.95,39.79 R10.2
N$19
  Top 0.406: R7.2 R13.2 R14.2 | R7.2 C14.2 | R7.2 16.05,27.14 | R7.2 15.95,27.14 C13.2 R5.1
N$20
  Top 0.406: MIC.P$4 MIC.P$5 13.95,25.49 R13.1
N$21
  Top 0.406: MIC.P$2 MIC.P$3 13.95,35.69 R14.1
N$22
  Top 0.406: R15.1 33.91,22.23 POWER_ON.A
N$23
  Top 0.406: SPEAKER.P$2 SPEAKER.P$3 9.65,21.94 R3.1 13.3,21.99 C11.2 C12.2
N$24  (via drill 0.4)
  Top 0.406: IC3.P$7 35.45,37.24 v37.6,35.09 | v75.1,18.09 75.1,7.9 X1.B7
  Bottom 0.406: v37.6,35.09 40,32.69 40,18.49 40.4,18.09 v75.1,18.09
N$25
  Top 0.406: SPEAKER.P$4 SPEAKER.P$5 13.3,11.19 R4.2 16.24,11.14 16.24,11.27 | 16.48,11.14 16.24,11.27 | 16.24,11.27 C9.2 C10.2
N$26  (via drill 0.4)
  Top 0.406: IC3.P$5 34.75,35.94 v36.5,34.19
  Bottom 0.406: v36.5,34.19 38.5,32.19 38.5,17.39 39.6,16.29 77.2,16.39 81.5,12.09 81.5,6.62 X1.A5
N$27
  Top 0.406: R12.1 79.35,9.24 79,8.89 79,6.66 X1.A6
N$28
  Bottom 0.406: X1.A28 23.07,6.61 R33.2
N$29
  Bottom 0.406: X1.A27 25.63,6.63 R34.2
N$30
  Bottom 0.406: IC1.6 53.29,38.08 53.7,38.49 86.4,38.49 88.7,36.19 97.4,36.19 99.6,33.99 99.6,13.29 96.7,10.39 91.8,5.39 90.43,5.39 X1.A1
N$31
  Bottom 0.406: X1.A26 28.19,6.65 R35.2
N$32
  Bottom 0.406: X1.A25 30.65,6.57 R36.2
N$33
  Bottom 0.406: X1.A23 35.77,6.61 R38.2
N$34
  Bottom 0.406: X1.A22 38.33,6.63 R39.2
N$35
  Bottom 0.406: X1.A21 40.79,6.55 R40.2
N$36
  Bottom 0.406: R25.2 43.39,6.61 X1.A20
N$37
  Top 0.406: X1.B24 31.95,9.95 R17.2
N$38
  Top 0.406: X1.B23 34.49,9.95 R18.2
N$39
  Top 0.406: X1.B22 37.03,9.95 R19.2
N$40  (via drill 0.4)
  Top 0.406: IC3.P$3 33.55,34.64 v35.3,32.89 | X1.B4 82.8,7.92 82.8,9.19 82.03,9.96 R12.2 81,10.02 81,11.09 80.5,11.59 v79,11.59
  Bottom 0.406: v35.3,32.89 36.9,31.29 36.9,16.59 39.4,14.09 76.5,14.09 v79,11.59
N$41
  Top 0.406: X1.B21 39.57,9.95 R20.2
N$42
  Top 0.406: X1.B20 42.11,9.95 R21.2
N$43
  Top 0.406: X1.B19 44.65,9.95 R22.2
N$44
  Top 0.406: X1.B18 47.19,9.95 R23.2
N$45
  Top 0.406: QG1_65MHZ.3 49.5,25.34 49.5,20.49 48.6,19.59 39.3,19.59 34.4,14.69 30.1,14.69 29.43,14.02 29.43,7.87 X1.B25
N$46
  Top 0.406: X1.B17 49.73,9.95 R24.2
N$47
  Bottom 0.406: R26.2 45.95,6.63 X1.A19
N$48
  Bottom 0.406: R42.2 51.25,44.17 52.01,43.41 52.01,42.2 IC1.2
N$49
  Bottom 0.406: R43.2 52.82,40.61 53.28,41.06 53.28,42.18 IC1.3
N$50  (via drill 0.4)
  Top 0.406: v73.7,12.99 73.7,23.49 76.2,25.99 79.05,25.99 R44.1 87.77,26.04 J1.3
  Bottom 0.406: R31.1 R30.1 R29.1 68.63,11.65 R28.1 R27.1 R26.1 R25.1 | R31.1 R32.1 | v73.7,12.99 73.7,11.78 R31.1
N$51
  Bottom 0.406: R27.2 48.41,6.55 X1.A18
N$52
  Bottom 0.406: U$1.5 D1.1 43.97,47.01 44.46,47.49 45.02,47.59 R41.1
N$53
  Bottom 0.406: U$1.3 42.51,41.25 45.72,41.25 45.87,41.4 D1.3 45.87,44.35 R42.1
N$54
  Bottom 0.406: R28.2 50.97,6.57 X1.A17
N$55
  Bottom 0.406: U$1.1 41.13,37.12 42.35,37.12 42.8,37.57 42.8,39.28 43.23,39.72 D1.6 43.97,40.45 44.2,40.68 47.13,40.68 R43.1
N$56
  Top 0.406: X1.B26 26.89,7.87 26.89,14.78 27.6,15.49 34.2,15.49 39,20.29 45.3,20.29 46.5,21.49 46.5,26.59 48.6,28.69 52.3,28.69 53.2,29.59 QG1_40MHZ1.3
N$57
  Bottom 0.406: X1.A24 33.21,6.59 R37.2
N$58
  Bottom 0.406: R29.2 68.73,6.55 X1.A10
N$59
  Bottom 0.406: R32.2 76.37,6.57 X1.A7
N$60
  Bottom 0.406: R31.2 73.73,6.47 X1.A8
N$61
  Bottom 0.406: R30.2 71.29,6.57 X1.A9
N$62
  Top 0.406: R17.1 R18.1 | R18.1 34.4,11.65 34.4,13.09 39.8,18.49 58.6,18.49 70.95,30.84 R46.1 79.13,30.81 J1.1 | R24.1 R23.1 R22.1 R21.1 R20.1 R19.1 R18.1
N$63
  Bottom 0.406: IC1.5 86.8,36.79 88.3,35.29 97,35.29 98.6,33.69 98.6,13.89 91.3,6.59 89.1,6.59 X1.A2
N$67  (via drill 0.4)
  Top 0.406: v35.8,12.89 40.3,17.39 59.1,17.39 70.95,29.24 R45.1 85.35,29.24 86.1,28.49 87.93,28.49 J1.2
  Bottom 0.406: R40.1 R39.1 R38.1 | R38.1 R37.1 R36.1 R35.1 R34.1 R33.1 23.04,11.68 | 35.8,11.68 R38.1 | v35.8,12.89 35.8,11.65 R38.1
N$86
  Top 0.406: IC3.P$16 22.9,41.14 22.5,41.54 22.5,42.87 C15.2 C16.2
SCK/H_SYNC  (via drill 0.4)
  Top 0.406: v42,23.19 39.4,23.19 33.7,17.49 25.1,17.49 21.8,14.19 X1.B28
  Bottom 0.406: v42,23.19 46.31,27.5 72.19,27.5 81,27.49 82.9,27.49 83.8,28.39 83.8,32.99 85.3,34.49 93.4,34.49 96.8,31.09 96.8,27.7 J1.14
VCC_DAC  (via drill 0.5, 0.6)
  Top 0.406: 31.5,21.34 L6.2 31.58,21.3 30.88,20.6 C21.2 | C5.2 33.33,42.97 IC3.P$14 | IC3.P$8 34.1,37.89 C7.2 | 36.77,38.12 v36.8,38.09
  Top 0.61: C7.2 C8.2 36.77,38.12 | v31.5,22.6 31.5,21.34 | C5.2 C6.2 36.12,42.97 36.8,42.29 v36.8,38.09
  Bottom 0.406: 36.77,38.12 v36.8,38.09
  Bottom 0.61: v31.5,22.6 31.5,25.79 33.5,27.79 33.5,37.02 34.6,38.12 36.77,38.12

### Text on the board
tNames: ELM-Board | Sound & VGA | Florian Allgäuer | Raffael Gächter | Sven Schlömmer | 1 | 32 | 31 | 30 | 29 | 28 | 27 | 26 | 25 | 16 | 15 | 14 | 13 | 12 | 11 | 10 | 9 | 8 | 7 | 6 | 3 | 2 | 1 | B | A | 32